# Altium project Merlab.PrjPcb
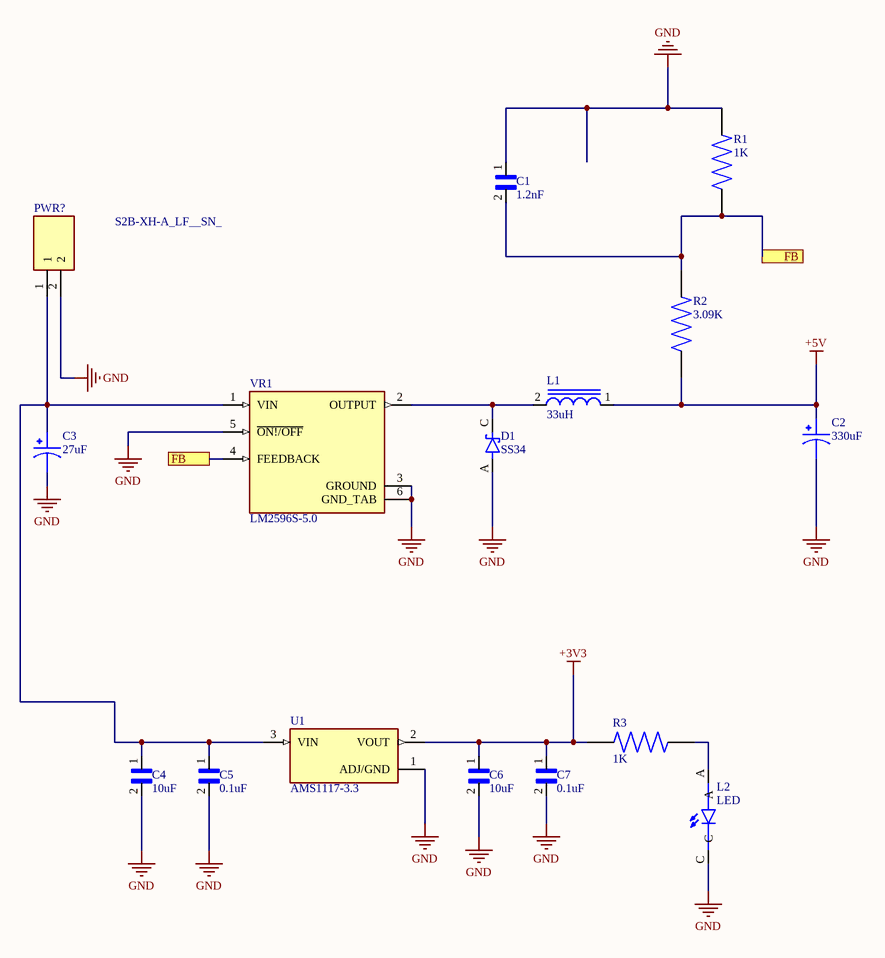
[diagram p0: power_module.SchDoc]
3 sheets, 59 parts. Net scope: flat (ports and power ports of the same name join across sheets).
Board file: merlab_pcb_v0.PcbDoc
Sheets:
  power_module.SchDoc
  MCU_STM32.SchDoc
  MCU_Con.SchDoc

## Sheet power_module.SchDoc
size A4; SheetNumber: 1; SheetTotal: 3

### Parts
C1  1.2nF  [CAP0805]
C2  330uF  [CAP220uF]
C3  27uF  [CAP220uF]
C4  10uF  [CAP0805]
C5  0.1uF  [CAP0805]
C6  10uF  [CAP0805]
C7  0.1uF  [CAP0805]
D1  SS34  [SS34DIODE]
L1  33uH  [INDUCTOR]
L2  LED  [LED]
PWR?  S2B-XH-A_LF__SN_  [SHDRRA2W80P0X250_1X2_740X1150X610P]
R1  1K  [RES0805]
R2  3.09K  [RES0805]
R3  1K  [RES0805]
U1  AMS1117-3.3  [SOT229P700X180-4N]
VR1  LM2596S-5.0  [LM2596S]

### Ports
FB

### Nets
+3V3: C6.1 C7.1 R3.2 U1.2(VOUT)
+5V: C2.1 L1.1 R2.1
GND: C1.1 C2.2 C3.2 C4.2 C5.2 C6.2 C7.2 D1.A L2.C PWR?.2 R1.2 U1.1(ADJ/GND) VR1.3(GROUND) VR1.5(~{ON!/OFF}) VR1.6(GND_TAB)
NetC1_2: C1.2 R1.1 R2.2 VR1.4(FEEDBACK) ; port FB
NetC3_1: C3.1 C4.1 C5.1 PWR?.1 U1.3(VIN) VR1.1(VIN)
NetD1_C: D1.C(K) L1.2 VR1.2(OUTPUT)
NetL2_A: L2.A R3.1

### Library data of the parts
C1 C4-C7 = CAP0805: 10000pF Â±5% 16V Ceramic Capacitor X7R 0805 _2012 Metric_; MF: AVX; MP: 0805YC103J4T2A; Package: 2012 AVX; Availability: Unavailable; Value: *; SnapEDA_Link: https://www.snapeda.com/parts/0805YC103J4T2A/AVX/view-part/606803/?ref=snap; Price: None
C2 C3 = CAP: 220µF 35V AND 100µf 50V Aluminum Electrolytic Capacitors Radial, Can 98.8mOhm @ 120Hz 2000 Hrs @ 85Â°C; MP: 478CKS010M; MF: Illinois Capacitor; SnapEDA_Link: https://www.snapeda.com/parts/478CKS010M/Illinois%20Capacitor/view-part/2347563/?ref=snap; Price: None; Mouser-Purchase-URL: https://snapeda.com/shop?store=Mouser&id=2347563; Availability: Warning; Package: Radial Illinois Capacitor; Value: *
D1 = SS34: Diode Schottky 40V 3A Surface Mount SMC _DO-214AB_; MF: ON Semiconductor; SnapEDA_Link: https://www.snapeda.com/parts/SS34/ON%20Semiconductor/view-part/4631325/?ref=snap; MP: SS34; Availability: Unavailable; Price: None; Value: *; Package: DO-214AB-214 ON Semiconductor
L1 = INDUCTOR: 33ÂµH Shielded Wirewound Inductor 3A 60mOhm Max Nonstandard; MF: Bourns; MP: SRR1260-330M; Price: None; Package: Nonstandard Bourns; Value: *; SnapEDA_Link: https://www.snapeda.com/parts/SRR1260-330M/Bourns/view-part/378985/?ref=snap; Availability: Unavailable
L2 = LED: Red LED Indication - Discrete 2V 0805 _2012 Metric_; MF: Lumex Opto/Components; MP: SML-LXT0805IW-TR; Value: *; Package: 0805 Lumex; Price: None; Availability: Unavailable; SnapEDA_Link: https://www.snapeda.com/parts/SML-LXT0805IW-TR/Lumex%20Opto/Components%20Inc./view-part/340416/?ref=snap
PWR? = S2B-XH-A_LF__SN_: XH-2.5mm Header side entry 2 way JST XH Series, Series Number S2B, 2.5mm Pitch 2 Way 1 Row Right Angle PCB Header, Solder Termination, 3A; Manufacturer_Name: JST (JAPAN SOLDERLESS TERMINALS); Manufacturer_Part_Number: S2B-XH-A(LF)(SN); Geometry.Height: 6.1mm; Mouser Part Number: *; Mouser Price/Stock: *; Arrow Part Number: S2B-XH-A(LF)(SN); Arrow Price/Stock: https://www.arrow.com/en/products/s2b-xh-a-lf-sn/jst-manufacturing?region=europe; Datasheet Link: http://www.jst-mfg.com/product/pdf/eng/eXH.pdf
R1-R3 = RES0805: 910 Ohms Â±1% 0.125W, 1/8W Chip Resistor 0805 _2012 Metric_ Moisture Resistant Thick Film; MF: Yageo; MP: RC0805FR-07910RL; Package: 2012 Rohm Semiconductor; Availability: Unavailable; Value: *; SnapEDA_Link: https://www.snapeda.com/parts/RC0805FR-07910RL/Yageo/view-part/106117/?ref=snap; Price: None
U1 = AMS1117-3.3: Sot223/Pkg 1-Amp 3.3-Volt Low Drop Out Voltage Regulatator; MF: Advanced Monolithic Systems; Price: None; Package: None; Value: *; MP: AMS1117-3.3; Availability: Unavailable; SnapEDA_Link: https://www.snapeda.com/parts/AMS1117-3.3/Advanced%20Monolithic%20Systems/view-part/53450/?ref=snap
VR1 = LM2596S-5.0: SIMPLE SWITCHER&reg; 4.5V to 40V, 3A Low Component Count Step-Down Regulator 5-DDPAK/TO-263; MF: Texas Instruments; MP: LM2596S-5.0/NOPB; DigiKey-Purchase-URL: https://snapeda.com/shop?store=DigiKey&id=15588; Mouser-Purchase-URL: https://snapeda.com/shop?store=Mouser&id=15588; SnapEDA_Link: https://www.snapeda.com/parts/LM2596S-5.0/NOPB/Texas%20Instruments/view-part/15588/?ref=snap; Price: None; Value: *; Availability: Good; Texas_Instruments-Purchase-URL: https://snapeda.com/shop?store=Texas+Instruments&id=15588; Package: TO-263-5 Texas Instruments

## Sheet MCU_STM32.SchDoc
size A4; SheetNumber: 2; SheetTotal: 3
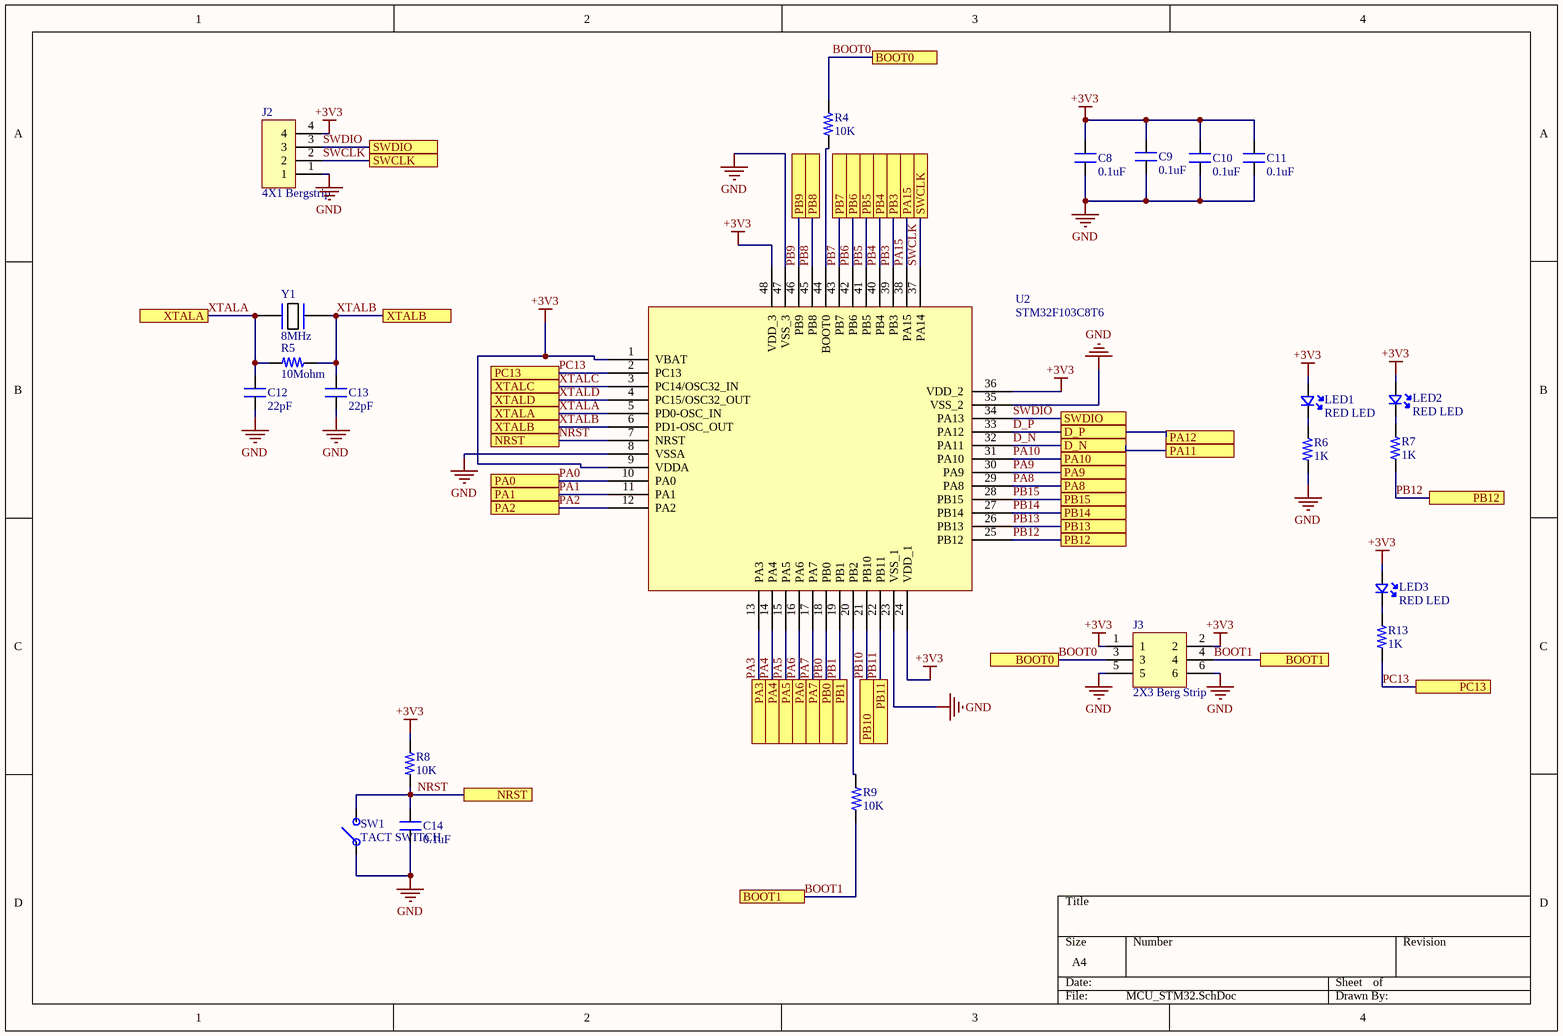
[diagram p1: MCU_STM32.SchDoc]

### Parts
C8  0.1uF  [CAP_0805]
C9  0.1uF  [CAP_0805]
C10  0.1uF  [CAP_0805]
C11  0.1uF  [CAP_0805]
C12  22pF  [CAP_0805]
C13  22pF  [CAP_0805]
C14  0.1uF  [CAP_0805]
J2  4X1 Bergstrip  [CON4_100_40D72_TH_ST_MALE]
J3  2X3 Berg Strip  [CON6_100_59D78_TH_ST_Duplicate]
LED1  RED LED  [LED_0805]
LED2  RED LED  [LED_0805]
LED3  RED LED  [LED_0805]
R4  10K  [RES_0805]
R5  10Mohm  [RES_0805]
R6  1K  [RES_0805]
R7  1K  [RES_0805]
R8  10K  [RES_0805]
R9  10K  [RES_0805]
R13  1K  [RES_0805]
SW1  TACT SWITCH  [SW_342_SMD]
U2  STM32F103C8T6  [LQFP-48_19.6_393_58X11_SMD]
Y1  8MHz  [XTAL_314_240X47_SMD]

### Ports
BOOT0, BOOT1, D_N, D_P, NRST, PA0, PA1, PA2, PA3, PA4, PA5, PA6, PA7, PA8, PA9, PA10, PA11, PA12, PA15, PB0, PB1, PB3, PB4, PB5, PB6, PB7, PB8, PB9, PB10, PB11, PB12, PB13, PB14, PB15, PC13, SWCLK, SWDIO, XTALA, XTALB, XTALC, XTALD

### Nets
+3V3: C8.2 C9.2 C10.2 C11.2 J2.4 J3.1 J3.2 LED1.A LED2.A LED3.A R8.2 U2.1(VBAT) U2.9(VDDA) U2.24(VDD_1) U2.36(VDD_2) U2.48(VDD_3)
GND: C8.1 C9.1 C10.1 C11.1 C12.1 C13.1 C14.1 J2.1 J3.5 J3.6 R6.1 SW1.1 U2.8(VSSA) U2.23(VSS_1) U2.35(VSS_2) U2.47(VSS_3)
BOOT0: J3.3 R4.2 ; port BOOT0
BOOT1: J3.4 R9.2 ; port BOOT1
D_N: U2.32(PA11) ; port D_N, port PA11
D_P: U2.33(PA12) ; port D_P, port PA12
NRST: C14.2 R8.1 SW1.2 U2.7(NRST) ; port NRST
PA0: U2.10(PA0) ; port PA0
PA1: U2.11(PA1) ; port PA1
PA2: U2.12(PA2) ; port PA2
PA3: U2.13(PA3) ; port PA3
PA4: U2.14(PA4) ; port PA4
PA5: U2.15(PA5) ; port PA5
PA6: U2.16(PA6) ; port PA6
PA7: U2.17(PA7) ; port PA7
PA8: U2.29(PA8) ; port PA8
PA9: U2.30(PA9) ; port PA9
PA10: U2.31(PA10) ; port PA10
PA15: U2.38(PA15) ; port PA15
PB0: U2.18(PB0) ; port PB0
PB1: U2.19(PB1) ; port PB1
PB3: U2.39(PB3) ; port PB3
PB4: U2.40(PB4) ; port PB4
PB5: U2.41(PB5) ; port PB5
PB6: U2.42(PB6) ; port PB6
PB7: U2.43(PB7) ; port PB7
PB8: U2.45(PB8) ; port PB8
PB9: U2.46(PB9) ; port PB9
PB10: U2.21(PB10) ; port PB10
PB11: U2.22(PB11) ; port PB11
PB12: R7.1 U2.25(PB12) ; port PB12
PB13: U2.26(PB13) ; port PB13
PB14: U2.27(PB14) ; port PB14
PB15: U2.28(PB15) ; port PB15
PC13: R13.1 U2.2(PC13) ; port PC13
SWCLK: J2.2 U2.37(PA14) ; port SWCLK
SWDIO: J2.3 U2.34(PA13) ; port SWDIO
XTALA: C12.2 R5.1 U2.5(PD0-OSC_IN) Y1.1 ; port XTALA
XTALB: C13.2 R5.2 U2.6(PD1-OSC_OUT) Y1.2 ; port XTALB
XTALC: U2.3(PC14/OSC32_IN) ; port XTALC
XTALD: U2.4(PC15/OSC32_OUT) ; port XTALD
NetLED1_K: LED1.K R6.2
NetLED2_K: LED2.K R7.2
NetLED3_K: LED3.K R13.2
NetR4_1: R4.1 U2.44(BOOT0)
NetR9_1: R9.1 U2.20(PB2)

### Library data of the parts
C8-C11 C14 = CAP_0.1uF-50V-5%-0805: 0.1µF ±5% 50V Ceramic Capacitor X7R 0805 (2012 Metric); Manufacturer: KEMET; Manufacturing Part Number: C0805C104J5RACTU; Case/Package: 0805 (2012 Metric); Supplier-1: Digikey; Supplier Part Number-1: 399-1171-1-ND
C12 C13 = CAP_22pF-50V-5%-0805: 22pF ±5% 50V Ceramic Capacitor C0G, NP0 0805 (2012 Metric); Manufacturer: KEMET; Manufacturer Part Number: C0805C220J5GACTU; Case/Package: 0805; Supplier-1: Digikey; Supplier Part Number-1: 399-1113-1-ND
J2 = CON-BS-PLG_4X1-100-TH-ST: 4 pin, 1 row, 2.54mm pitch bergstrip; Manufacturer: NA; Manufacturing Part Number: NA; Case/Package: TH; Supplier-1: NA; Supplier Part Number-1: NA
J3 = CON-BS-PLG_2X3-100-TH-ST: 6 pin, 2 row, 2.54mm pitch bergstrip; Manufacturer: NA; Manufacturer Part Number: NA; Case/Package: TH; Supplier-1: NA; Supplier Part Number-1: NA
LED1-LED3 = LED-RED_10mA-0805: Red 621nm LED Indication - Discrete 2V 0805 (2012 Metric); Manufacturer: Lite-On Inc.; Manufacturer Part Number: LTST-C170EKT; Case/ Package: 0805; Supplier-1: Digikey; Supplier Part Number-1: 160-1178-1-ND
R4 R8 R9 = RES_10K-0.125W-1%-0805: 10 kOhms ±1% 0.125W, 1/8W Chip Resistor 0805 (2012 Metric) Moisture Resistant Thick Film; Manufacturer: Yageo; Manufacturing Part Number: RC0805FR-0710KL; Case/Package: 0805; Supplier-1: Digikey; Supplier Part Number-1: 311-10.0KCRCT-ND
R5 = RES_10MOHM-0.125W-1%-0805: 10 MOhms ±1% 0.125W, 1/8W Chip Resistor 0805 (2012 Metric) Automotive AEC-Q200, High Voltage Thick Film; Manufacturer: Rohm Semiconductor; Manufacturing Part Number: KTR10EZPF1005; Case/Package: 0805 (2012 Metric); Supplier-1: Digikey; Supplier Part Number-1: RHM10.0MAHCT-ND
R6 R7 R13 = RES_1K-0.125W-1%-0805: 1 kOhms ±1% 0.125W, 1/8W Chip Resistor 0805 (2012 Metric) Moisture Resistant Thick Film; Manufacturer: 垈㎵á; Manufacturer Part Number: RC0805FR-071KL; Case/Package: 0805; Supplier-1: Digikey; Supplier Part Number-1: 311-1.00KCRCT-ND
SW1 = SW_KSR223GLFG-SMD: Tactile Switch SPST-NO Top Actuated Surface Mount; Manufacturer: C&K; Manufacturing Part Number: KSR223GLFG; Case/Package: SMD; Supplier-1: Digikey; Supplier Part Number-1: 401-1704-1-ND
U2 = IC-STM32F103C8T6 _1: ARM® Cortex®-M3 STM32F1 Microcontroller IC 32-Bit 72MHz 64KB (64K x 8) FLASH; Manufacturer: STMicroelectronics; Manufacturer Part Number: STM32F103C8T6; Case/Package: 48-LQFP; Supplier-1: Digikey; Supplier Part Number-1: 497-6063-ND
Y1 = XTAL_8MHZ-LFXTAL030234: Crystals 8MHz 22pF -20C 70C; Manufacturer: IQD Frequency Products; Manufacturing Part Number: LFXTAL030234Reel; Case/Package: SMD; Supplier-1: Mouser; Supplier Part Number-1: 449-LFXTAL030234REEL

## Sheet MCU_Con.SchDoc
size A4; SheetNumber: 3; SheetTotal: 3
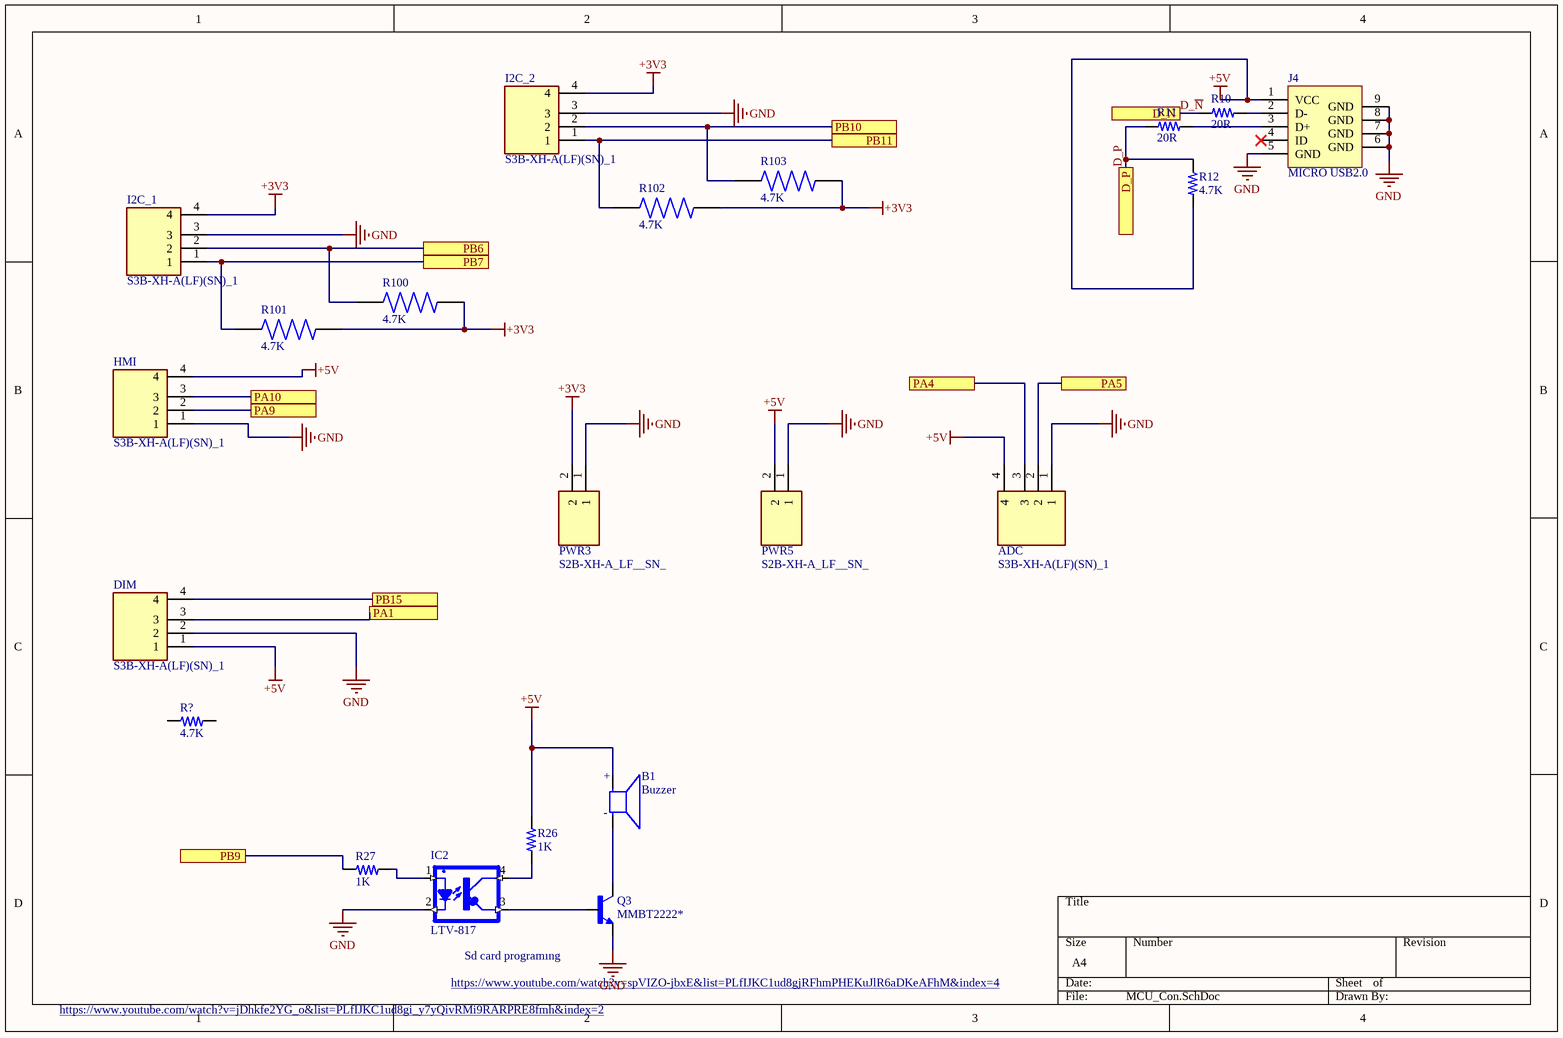
[diagram p2: MCU_Con.SchDoc]

### Parts
ADC  S3B-XH-A(LF)(SN)_1  [JST_S4B-XH-A(LF)(SN)]
B1  Buzzer  [BUZZ]
DIM  S3B-XH-A(LF)(SN)_1  [JST_S4B-XH-A(LF)(SN)]
HMI  S3B-XH-A(LF)(SN)_1  [JST_S4B-XH-A(LF)(SN)]
I2C_1  S3B-XH-A(LF)(SN)_1  [JST_S4B-XH-A(LF)(SN)]
I2C_2  S3B-XH-A(LF)(SN)_1  [JST_S4B-XH-A(LF)(SN)]
IC2  LTV-817  [OPTO]
J4  MICRO USB2.0  [CON_10118192-0001LF_SMD]
PWR3  S2B-XH-A_LF__SN_  [SHDRRA2W80P0X250_1X2_740X1150X610P]
PWR5  S2B-XH-A_LF__SN_  [SHDRRA2W80P0X250_1X2_740X1150X610P]
Q3  MMBT2222*  [SOT23-BEC]
R10  20R  [RES_0805]
R11  20R  [RES_0805]
R12  4.7K  [RES_0805]
R26  1K  [RES_0805]
R27  1K  [RES_0805]
R100  4.7K  [RES0805]
R101  4.7K  [RES0805]
R102  4.7K  [RES0805]
R103  4.7K  [RES0805]
R?  4.7K  [RES_0805]

### Ports
D_N, D_P, PA1, PA4, PA5, PA9, PA10, PB6, PB7, PB9, PB10, PB11, PB15

### Nets
+3V3: I2C_1.4 I2C_2.4 PWR3.2 R100.1 R101.1 R102.1 R103.1
+5V: ADC.4 B1.P DIM.1 HMI.4 J4.1(VCC) PWR5.2 R12.1 R26.2
GND: ADC.1 DIM.2 HMI.1 I2C_1.3 I2C_2.3 IC2.2 J4.5(GND) J4.6(GND) J4.7(GND) J4.8(GND) J4.9(GND) PWR3.1 PWR5.1 Q3.E
D_~{N}: R10.1 ; port D_N  [project net D_N]
D_P: R11.1 R12.2 ; port D_P
PA1: DIM.3 ; port PA1
PA4: ADC.3 ; port PA4
PA5: ADC.2 ; port PA5
PA9: HMI.2 ; port PA9
PA10: HMI.3 ; port PA10
PB6: I2C_1.2 R100.2 ; port PB6
PB7: I2C_1.1 R101.2 ; port PB7
PB9: R27.2 ; port PB9
PB10: I2C_2.2 R103.2 ; port PB10
PB11: I2C_2.1 R102.2 ; port PB11
PB15: DIM.4 ; port PB15
NetB1_N: B1.N Q3.C
NetIC2_1: IC2.1 R27.1
NetIC2_3: IC2.3 Q3.B
NetIC2_4: IC2.4 R26.1
NetJ4_2: J4.2(D-) R10.2
NetJ4_3: J4.3(D+) R11.2

Not connected (* = marked no-connect by the designer): J4 4(ID)*; R? 1 2

### Notes on the sheet
- https://www.youtube.com/watch?v=spVIZO-jbxE&list=PLfIJKC1ud8gjRFhmPHEKuJlR6aDKeAFhM&index=4
- Sd card programıng
- https://www.youtube.com/watch?v=jDhkfe2YG_o&list=PLfIJKC1ud8gi_y7yQivRMi9RARPRE8fmh&index=2
- (in symbol Buzzer) +; -

### Library data of the parts
ADC DIM HMI I2C_1 I2C_2 = S3B-XH-A(LF)(SN)_1: Connector Header Through Hole, Right Angle 3 position 0.098 (2.50mm); MF: JST Sales; Purchase-URL: https://pricing.snapeda.com/search/part/S3B-XH-A(LF)(SN)/?ref=eda; Check_prices: https://www.snapeda.com/parts/S3B-XH-A(LF)(SN)/JST+Sales+America+Inc./view-part/?ref=eda; Package: Custom Package JST Sales; SnapEDA_Link: https://www.snapeda.com/parts/S3B-XH-A(LF)(SN)/JST+Sales+America+Inc./view-part/?ref=snap; Value: *; MP: S3B-XH-A(LF)(SN); Digi-Key_Part_Number: 455-2250-ND
B1 = Buzzer: 9.6 mm, 3 Vdc, 80 dB, Through Hole, Driving Circuit, Magnetic Audio Indicator Buzzer; MP: CMI-9605IC-0380T; MF: CUI Devices; Availability: Unavailable; SnapEDA_Link: https://www.snapeda.com/parts/CMI-9605IC-0380T/CUI%20Devices/view-part/4413414/?ref=snap; Value: *; Package: Package; Price: None
IC2 = LTV-817: Optoisolator Transistor Output 5000Vrms 1 Channel 4-SMD; MF: Lite-On Electronics; SnapEDA_Link: https://www.snapeda.com/parts/LTV-817/ICS/view-part/4478599/?ref=snap; Price: None; MP: LTV-817; Value: *; Availability: Unavailable; Package: DIP-4 Lite-On Electronics
J4 = CON-USB_10118192-0002LF-SMD: USB - micro B USB 2.0 Receptacle Connector 5 Position Surface Mount, Right Angle; Manufacturer: Amphenol ICC (FCI); Manufacturing Part Number: 10118192-0002LF; Case/Package: SMD; Supplier-1: Digikey; Supplier Part Number-1: 609-5379-1-ND
PWR3 PWR5 = S2B-XH-A_LF__SN_: as PWR? on sheet power_module; Mouser Part Number: *; Mouser Price/Stock: *; Arrow Part Number: S2B-XH-A(LF)(SN); Arrow Price/Stock: https://www.arrow.com/en/products/s2b-xh-a-lf-sn/jst-manufacturing?region=europe; Datasheet Link: http://www.jst-mfg.com/product/pdf/eng/eXH.pdf
Q3 = MMBT2222*: <b>NPN Transistor</b>; MP: MMBT2222-; MF: {'manufacturer': u'ON Semiconductor'}; Package: None; Price: None; Availability: Unavailable; Value: *
R10-R12 R26 R27 R? = RES_1K-0.125W-1%-0805: as R6 on sheet MCU_STM32; Case/Package: 0805; Supplier-1: Digikey; Supplier Part Number-1: 311-1.00KCRCT-ND
R100-R103 = RES0805: as R1 on sheet power_module; Package: 2012 Rohm Semiconductor; Availability: Unavailable; Value: *; SnapEDA_Link: https://www.snapeda.com/parts/RC0805FR-07910RL/Yageo/view-part/106117/?ref=snap; Price: None

## Nets that join several sheets
+3V3: power_module (C6.1 C7.1 R3.2 U1.2), MCU_STM32 (16 pins), MCU_Con (7 pins)
+5V: power_module (C2.1 L1.1 R2.1), MCU_Con (8 pins)
GND: power_module (15 pins), MCU_STM32 (16 pins), MCU_Con (14 pins)
D_N: MCU_STM32 (U2.32), MCU_Con (R10.1)
D_P: MCU_STM32 (U2.33), MCU_Con (R11.1 R12.2)
PA1: MCU_STM32 (U2.11), MCU_Con (DIM.3)
PA4: MCU_STM32 (U2.14), MCU_Con (ADC.3)
PA5: MCU_STM32 (U2.15), MCU_Con (ADC.2)
PA9: MCU_STM32 (U2.30), MCU_Con (HMI.2)
PA10: MCU_STM32 (U2.31), MCU_Con (HMI.3)
PB6: MCU_STM32 (U2.42), MCU_Con (I2C_1.2 R100.2)
PB7: MCU_STM32 (U2.43), MCU_Con (I2C_1.1 R101.2)
PB9: MCU_STM32 (U2.46), MCU_Con (R27.2)
PB10: MCU_STM32 (U2.21), MCU_Con (I2C_2.2 R103.2)
PB11: MCU_STM32 (U2.22), MCU_Con (I2C_2.1 R102.2)
PB15: MCU_STM32 (U2.28), MCU_Con (DIM.4)